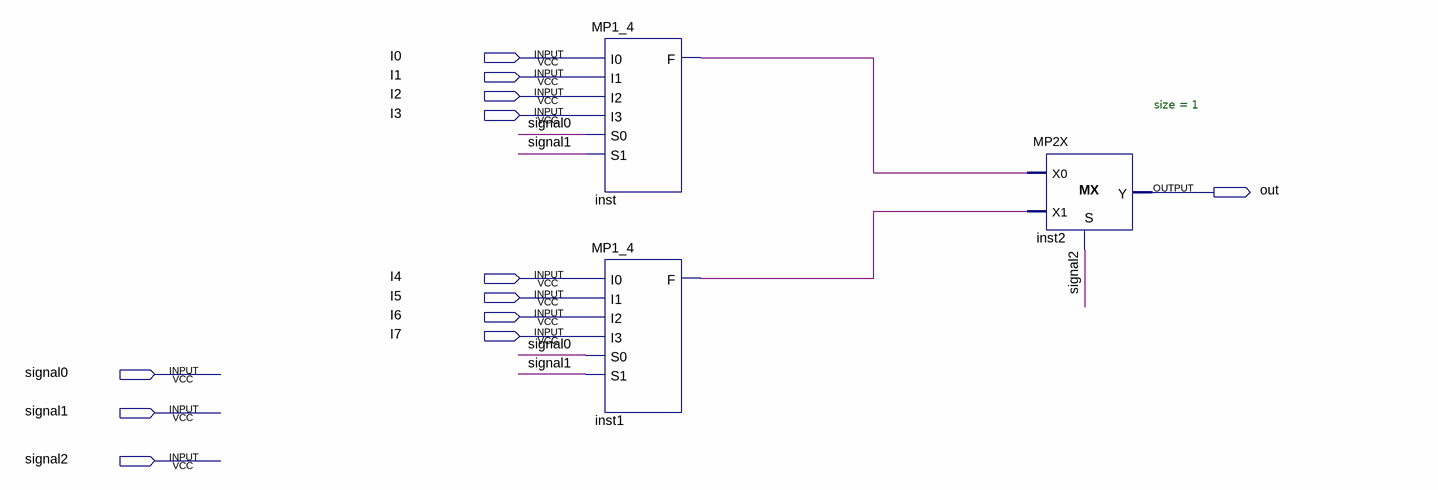
[diagram p0: schematic sheet]
// Quartus schematic MP1_8.bdf as structural Verilog: 3 symbols, 12 pins
module MP1_8 (
  input  I0,
  input  I1,
  input  I2,
  input  I3,
  input  I4,
  input  I5,
  input  I6,
  input  I7,
  input  signal0,
  input  signal1,
  input  signal2,
  output out
);

  wire inst1_f, inst_f;

  MP1_4 inst (.I0(I0), .I1(I1), .I2(I2), .I3(I3), .S0(signal0), .S1(signal1), .F(inst_f));
  MP1_4 inst1 (.I0(I4), .I1(I5), .I2(I6), .I3(I7), .S0(signal0), .S1(signal1), .F(inst1_f));
  MP2X #(.size(1)) inst2 (.S(signal2), .X0(inst_f), .X1(inst1_f), .Y(out));
endmodule
